# EAGLE design VKeyVoltageKeypad (EAGLE 6.0)
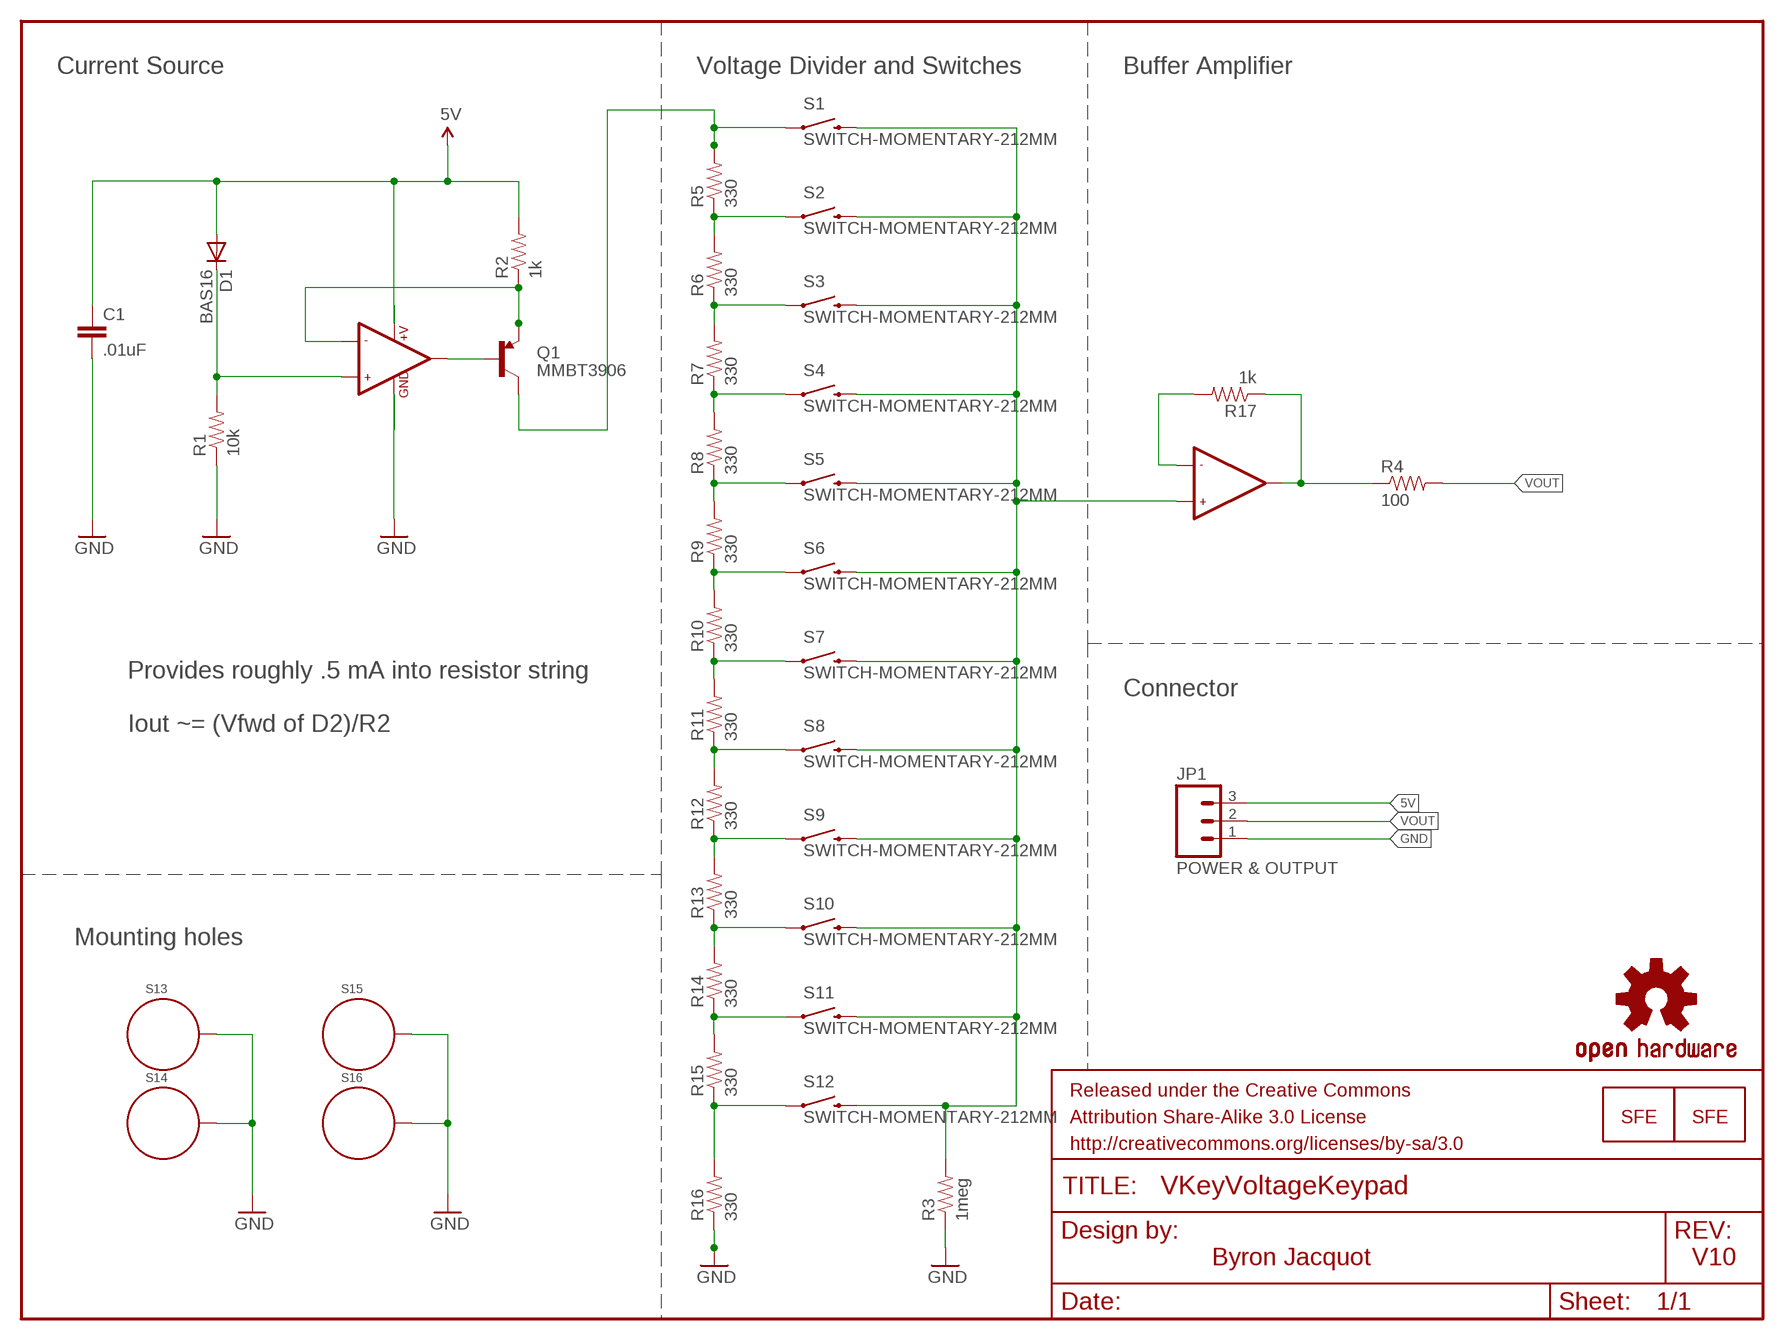
[diagram p0: schematic, sheet 1]

## Parts
C1  .01uF  10NF/10000PF-50V-10%(0603)  [0603-CAP]
D1  BAS16  DIODESOD  [SOD-323]
FRAME1  FRAME-LETTER  [CREATIVE_COMMONS]
JP1  POWER & OUTPUT  M031X03_NO_SILK  [1X03_NO_SILK]
LOGO1  LOGO-SFENEW  [SFE-NEW-WEBLOGO]
LOGO2  LOGO-SFENEW  [SFE-NEW-WEBLOGO]
LOGO3  OSHW-LOGOM  [OSHW-LOGO-M]
LOGO4  OSHW-LOGOL  [OSHW-LOGO-L]
Q1  MMBT3906  TRANSISTOR_PNPMMBT3906  [SOT23]
R1  10k  10KOHM1/10W1%(0603)0603  [0603-RES]
R2  1k  1KOHM1/10W1%(0603)  [0603-RES]
R3  1meg  1M-1%  [0603-RES]
R4  100  100OHM1/10W1%(0603)  [0603-RES]
R5  330  330OHM1/10W1%(0603)  [0603-RES]
R6  330  330OHM1/10W1%(0603)  [0603-RES]
R7  330  330OHM1/10W1%(0603)  [0603-RES]
R8  330  330OHM1/10W1%(0603)  [0603-RES]
R9  330  330OHM1/10W1%(0603)  [0603-RES]
R10  330  330OHM1/10W1%(0603)  [0603-RES]
R11  330  330OHM1/10W1%(0603)  [0603-RES]
R12  330  330OHM1/10W1%(0603)  [0603-RES]
R13  330  330OHM1/10W1%(0603)  [0603-RES]
R14  330  330OHM1/10W1%(0603)  [0603-RES]
R15  330  330OHM1/10W1%(0603)  [0603-RES]
R16  330  330OHM1/10W1%(0603)  [0603-RES]
R17  1k  1KOHM1/10W1%(0603)  [0603-RES]
S1  SWITCH-MOMENTARY-212MM  [TACTILE-PTH-12MM]
S2  SWITCH-MOMENTARY-212MM  [TACTILE-PTH-12MM]
S3  SWITCH-MOMENTARY-212MM  [TACTILE-PTH-12MM]
S4  SWITCH-MOMENTARY-212MM  [TACTILE-PTH-12MM]
S5  SWITCH-MOMENTARY-212MM  [TACTILE-PTH-12MM]
S6  SWITCH-MOMENTARY-212MM  [TACTILE-PTH-12MM]
S7  SWITCH-MOMENTARY-212MM  [TACTILE-PTH-12MM]
S8  SWITCH-MOMENTARY-212MM  [TACTILE-PTH-12MM]
S9  SWITCH-MOMENTARY-212MM  [TACTILE-PTH-12MM]
S10  SWITCH-MOMENTARY-212MM  [TACTILE-PTH-12MM]
S11  SWITCH-MOMENTARY-212MM  [TACTILE-PTH-12MM]
S12  SWITCH-MOMENTARY-212MM  [TACTILE-PTH-12MM]
S13  STANDOFF_ELECTRICAL  [STANDOFF-ELECTRICAL]
S14  STANDOFF_ELECTRICAL  [STANDOFF-ELECTRICAL]
S15  STANDOFF_ELECTRICAL  [STANDOFF-ELECTRICAL]
S16  STANDOFF_ELECTRICAL  [STANDOFF-ELECTRICAL]
U1  LMV358  [SO08]

## Nets
5V: C1.1 D1.2(A) JP1.3 R2.2 U1.8(+V)
GND: C1.2 JP1.1 R1.1 R3.1 R16.1 S13.P1 S14.P1 S15.P1 S16.P1 U1.4(GND)
N$1: D1.1(C) R1.2 U1.3(+IN1)
N$2: Q1.1(B) U1.1(OUT1)
N$3: R3.2 S1.3 S2.3 S3.3 S4.3 S5.3 S6.3 S7.3 S8.3 S9.3 S10.3 S11.3 S12.3 U1.5(+IN2)
N$4: R14.1 R15.2 S11.1
N$5: Q1.2(E) R2.1 U1.2(-IN1)
N$6: Q1.3(C) R5.2 S1.1
N$7: R5.1 R6.2 S2.1
N$8: R6.1 R7.2 S3.1
N$9: R7.1 R8.2 S4.1
N$10: R8.1 R9.2 S5.1
N$11: R9.1 R10.2 S6.1
N$12: R10.1 R11.2 S7.1
N$13: R11.1 R12.2 S8.1
N$14: R12.1 R13.2 S9.1
N$15: R13.1 R14.2 S10.1
N$16: R15.1 R16.2 S12.1
N$17: R4.1 R17.1 U1.7(OUT2)
N$18: R17.2 U1.6(-IN2)
VOUT: JP1.2 R4.2

## Notes on the sheet
- Current Source | Voltage Divider and Switches | Buffer Amplifier
- Provides roughly .5 mA into resistor string
- Connector
- Iout ~= (Vfwd of D2)/R2
- Mounting holes
- Byron Jacquot | V10

## Library data of the parts
C1 = SparkFun-Capacitors:10NF/10000PF-50V-10%(0603): CAP-00867; PROD_ID: CAP-00867; VALUE: 10nF
D1 = SparkFun-DiscreteSemi:DIODE: Diode These are standard reverse protection diodes and small signal diodes. SMA package can handle up to about 1A. SOD-323 can handle about 200mA. What the SOD-323 package when ordering, there are some mfgs out there that are 5-pin packages.; PROD_ID: DIO-09646
FRAME1 = SparkFun-Aesthetics:FRAME-LETTER: Schematic Frame Standard 8.5x11 US Letter frame
JP1 = SparkFun-Connectors:M03: Header 3 Standard 3-pin 0.1" header. Use with straight break away headers (SKU : PRT-00116), right angle break away headers (PRT-00553), swiss pins (PRT-00743), machine pins (PRT-00117), and female headers (PRT-00115). Molex polarized connector foot print use with SKU : PRT-08232 with associated crimp pins and housings.
LOGO1 LOGO2 = SparkFun-Aesthetics:LOGO-SFE: Spark Fun Electronics PCB Logo This is the standard Spark Fun Electronics PCB logo.
LOGO3 LOGO4 = SparkFun-Aesthetics:OSHW-LOGO: Open Source Hardware Logo This logo indicates the piece of hardware it is found on incorporates a OSHW license and/or adheres to the definition of open source hardware found here: http://freedomdefined.org/OSHW
Q1 = SparkFun-DiscreteSemi:TRANSISTOR_PNP: Generic PNP BJT Double check pinouts against datasheets- not all devices are the same! MMBT3906 - 40V 200mA SOT-23 (TRANS-08052) MMBT4403 - 40V 600mA SOT-23 (TRANS-09245); PROD_ID: TRANS-08052
R1 = SparkFun-Resistors:10KOHM1/10W1%(0603): RES-00824; PROD_ID: RES-00824; VALUE: 10K
R2 R17 = SparkFun-Resistors:1KOHM1/10W1%(0603): RES-07856; PROD_ID: RES-07856; VALUE: 1K
R3 = SparkFun-Resistors:1M-1%: 1M-ohm SMT 1/10W - 1% (0603) RES-07868; PROD_ID: RES-07868; VALUE: 1M
R4 = SparkFun-Resistors:100OHM1/10W1%(0603): RES-07863; PROD_ID: RES-07863
R5-R16 = SparkFun-Resistors:330OHM1/10W1%(0603): RES-00818; PROD_ID: RES-00818
S1-S12 = SparkFun-Electromechanical:SWITCH-MOMENTARY-2: Various NO switches- pushbuttons, reed, etc; PROD_ID: SWCH-09185
S13-S16 = SparkFun-Electromechanical:STANDOFF_ELECTRICAL: A standoff intended to be an electrically connected point. Pad size and stop size allow for a #4 Phillips pan screw head to make a solid connection to the board.
U1 = SparkFun-AnalogIC:LMV358: Jellybean rail-to-rail output op-amp; PROD_ID: IC-09657

## Board
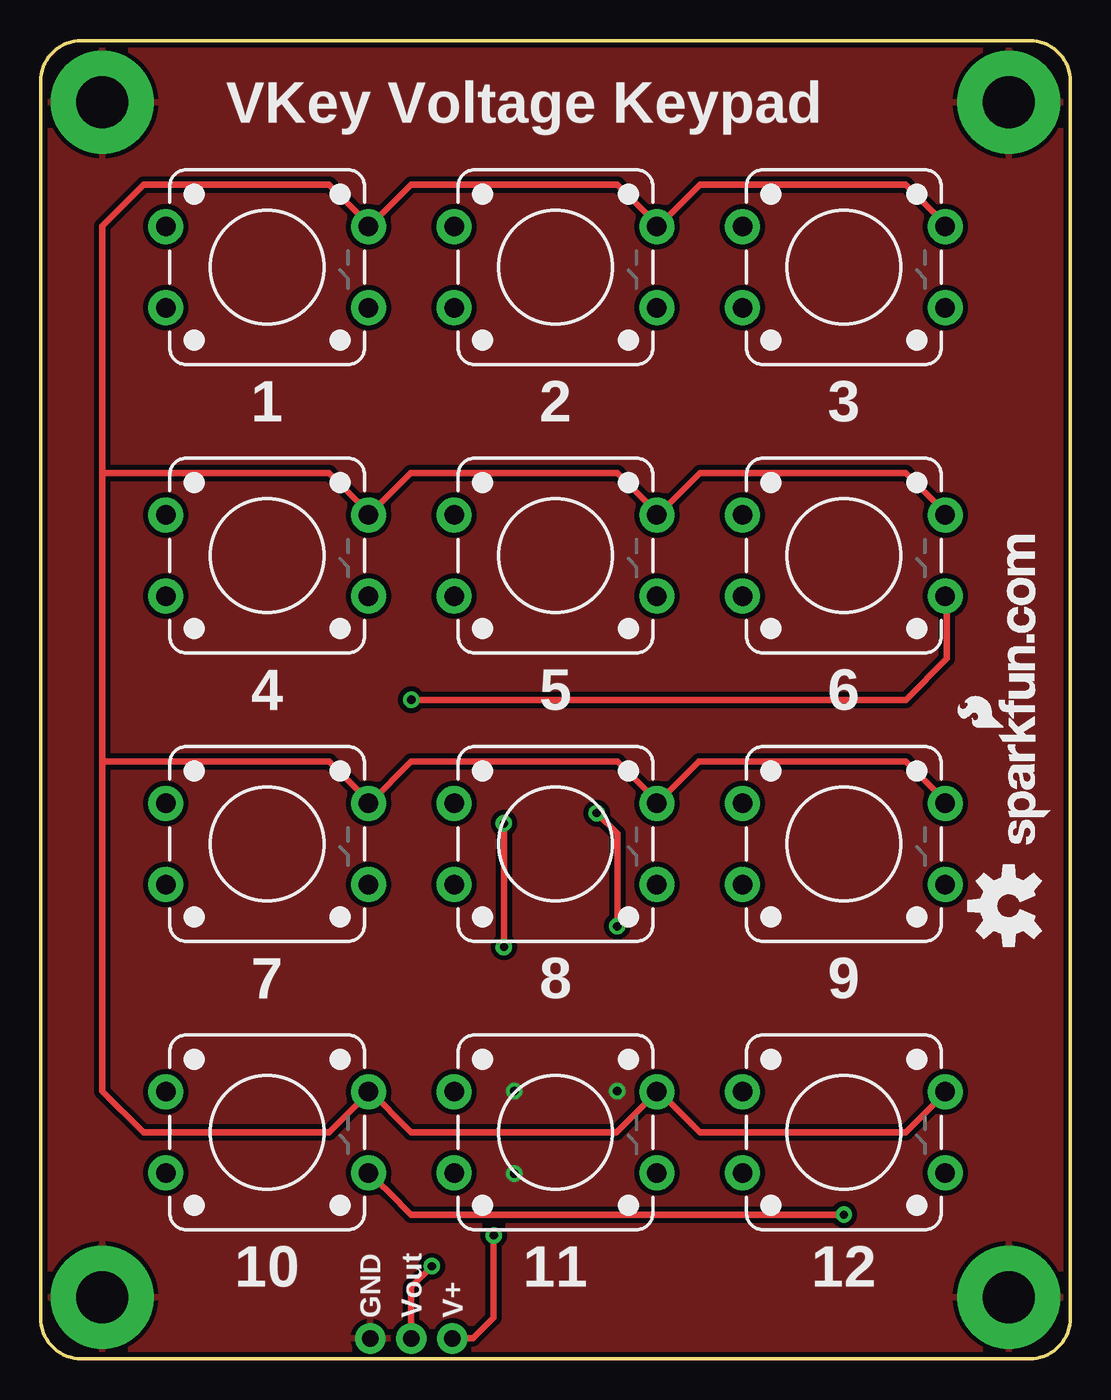
[diagram p1: board, top side]
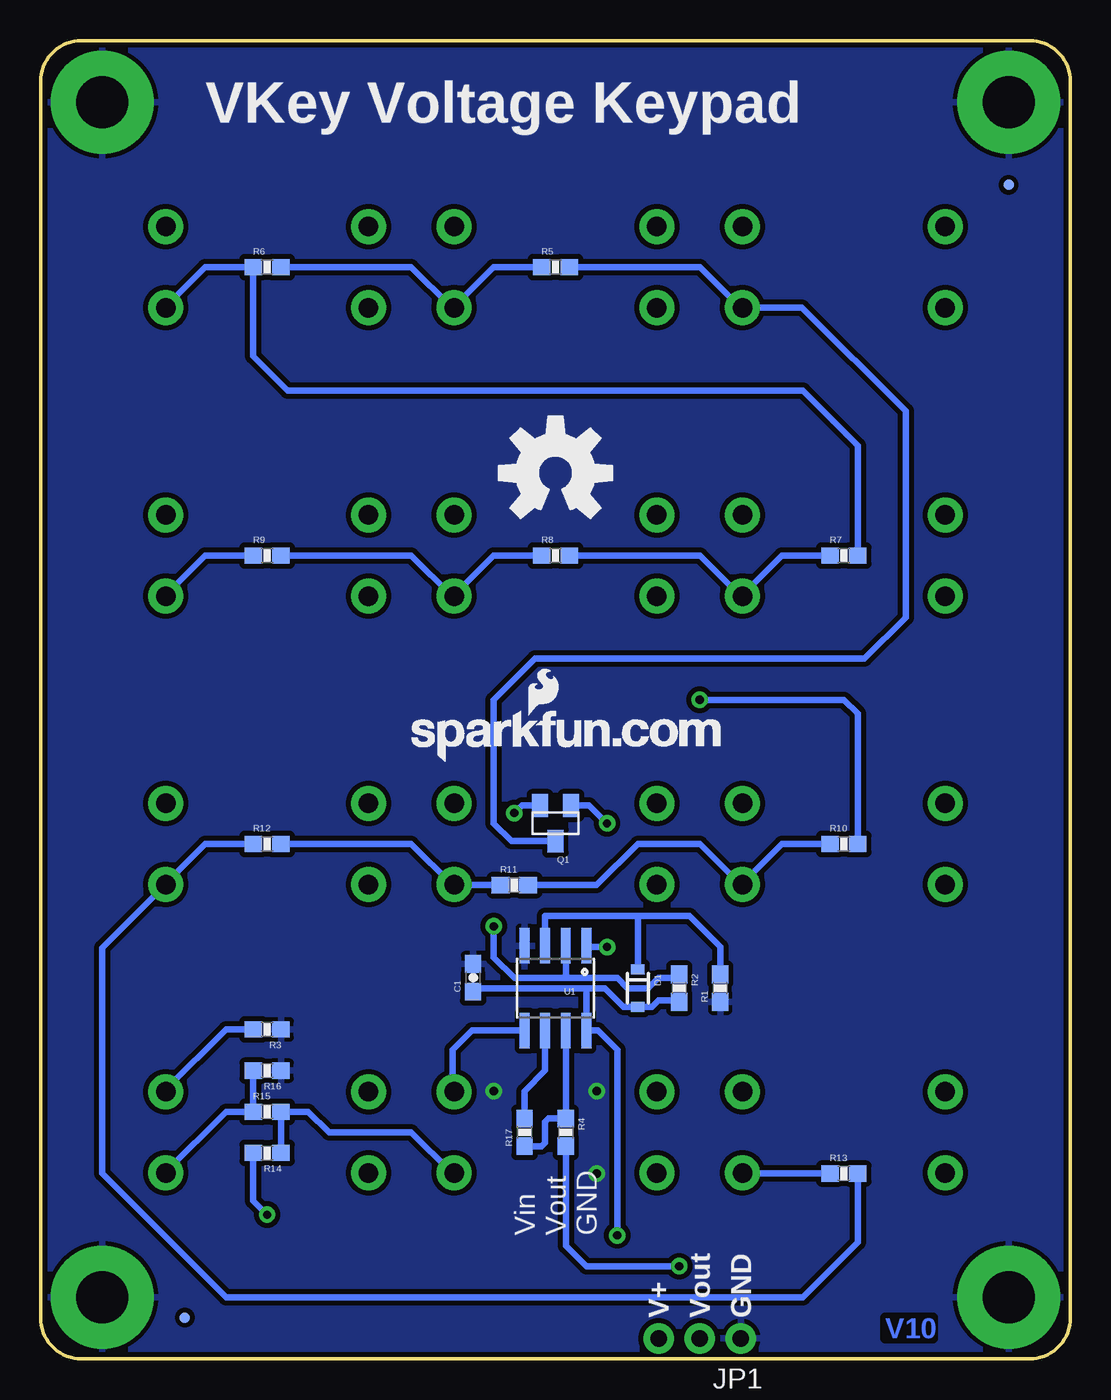
[diagram p2: board, bottom side, seen from below]

Size 63.5 x 81.28 mm. Coordinates in mm from the lower left corner, seen from the top.
Outline: 0,78.74 0,2.54 arc90 2.54,0 60.96,0 arc90 63.5,2.54 63.5,78.74 arc90 60.96,81.28 2.54,81.28 arc90 0,78.74
Copper layers (1*16): Top 0.035mm / dielectric 1.5mm / Bottom 0.035mm
Design rules "default": minimum track width 7mil, minimum drill 15mil, track to track 8mil, track to pad 8mil, pad to pad 8mil, via to via 8mil, smd to smd 8mil, copper to edge 8mil, drill to drill 8mil, minimum pad ring 12mil, minimum via ring 10mil, stop-mask expansion 4mil, vias tented up to drill 20mil, thermal gap 10mil

### Footprints (pad centres in the part's own frame; a part is rotated, then mirrored left to right if it is on the bottom)
0603-CAP = smd 1.1 x 1: 1 -0.85,0; 2 0.85,0
SOD-323 = smd 0.63 x 0.83: 1 -1.15,0; 2 1.15,0
MICRO-FIDUCIAL = smd 0.635 x 0.635: 1 0,0
1X03_NO_SILK = drill 1.016 pad 1.88: 1 0,0; 2 2.54,0; 3 5.08,0
SOT23 = smd 1 x 1.4: 1 -0.95,-1.1; 2 0.95,-1.1; 3 0,1.1
0603-RES = smd 1.1 x 1: 1 -0.85,0; 2 0.85,0
TACTILE-PTH-12MM = drill 1.2 pad 2.159: 1 6.25,-2.5; 2 -6.25,-2.5; 3 6.25,2.5; 4 -6.25,2.5
STANDOFF-ELECTRICAL = drill 3.2 pad 6.35: P1 0,0
SO08 = smd 0.61 x 2.21: 1 -1.905,-2.616; 2 -0.635,-2.616; 3 0.635,-2.616; 4 1.905,-2.616; 5 1.905,2.616; 6 0.635,2.616; 7 -0.635,2.616; 8 -1.905,2.616

### Placement (x,y rotation side)
C1  36.83,23.5 90 bottom
D1  26.67,22.86 270 bottom
FID1  FIDUCIALUFIDUCIAL  [MICRO-FIDUCIAL]  54.61,2.54 0 bottom
FID2  FIDUCIALUFIDUCIAL  [MICRO-FIDUCIAL]  3.81,72.39 0 bottom
FRAME1  13.97,-10.16 0 top  (outside the outline)
JP1  20.32,1.27 180 bottom
LOGO1  62.23,31.75 90 top
LOGO2  40.64,36.83 0 bottom
LOGO3  59.69,27.94 90 top
LOGO4  31.75,54.61 0 bottom
Q1  31.75,33.02 180 bottom
R1  21.59,22.86 90 bottom
R2  24.13,22.86 270 bottom
R3  49.53,20.32 180 bottom
R4  31.11,13.97 270 bottom
R5  31.75,67.31 0 bottom
R6  49.53,67.31 0 bottom
R7  13.97,49.53 0 bottom
R8  31.75,49.53 0 bottom
R9  49.53,49.53 0 bottom
R10  13.97,31.75 0 bottom
R11  34.29,29.21 0 bottom
R12  49.53,31.75 0 bottom
R13  13.97,11.43 0 bottom
R14  49.53,12.7 180 bottom
R15  49.53,15.24 0 bottom
R16  49.53,17.78 180 bottom
R17  33.66,13.97 90 bottom
S1  13.97,67.31 0 top
S2  31.75,67.31 0 top
S3  49.53,67.31 0 top
S4  13.97,49.53 0 top
S5  31.75,49.53 0 top
S6  49.53,49.53 0 top
S7  13.97,31.75 0 top
S8  31.75,31.75 0 top
S9  49.53,31.75 0 top
S10  13.97,13.97 0 top
S11  31.75,13.97 0 top
S12  49.53,13.97 0 top
S13  59.69,77.47 0 top
S14  59.69,3.81 0 top
S15  3.81,3.81 0 top
S16  3.81,77.47 0 top
U1  31.75,22.86 180 bottom

### Tracks (layer width: path | path; a pad name or v marks a point on that pad's centre or on a via)
5V  (via drill 0.51)
  Top 0.406: JP1.3 26.67,1.27 27.94,2.54 v27.94,7.62
  Bottom 0.406: 29.84,22.86 36.62,22.86 C1.1 | v27.94,7.62 27.94,19.05 29.13,20.24 U1.8 29.84,22.86 | 29.84,22.86 28.7,22.86 27.55,21.71 D1.2 25.79,21.71 25.4,22.1 25.39,22.09 24.21,22.09 R2.2
GND  (via drill 0.51)
  other vias: 35.56,16.51 29.21,16.51 29.21,11.43
  pour Bottom (isolate 0.305): 60.17,0.64 3.33,0.64 arc-90 0.64,3.33 0.64,77.95 arc-90 3.33,80.64 60.17,80.64 arc-90 62.87,77.95 62.87,3.33 arc-90
  pour Top (isolate 0.305): 60.17,0.64 3.33,0.64 arc-90 0.64,3.33 0.64,77.95 arc-90 3.33,80.64 60.17,80.64 arc-90 62.87,77.95 62.87,3.33 arc-90
N$1
  Bottom 0.406: 26.67,27.3 23.5,27.3 21.59,25.4 R1.2 | 26.67,27.3 32.38,27.3 U1.3 | D1.1 26.67,27.3
N$2  (via drill 0.51)
  Top 0.406: v28.57,25.4 v28.57,33.02
  Bottom 0.406: v28.57,33.02 29.68,34.12 Q1.1 | U1.1 29.77,25.4 v28.57,25.4
N$3
  Top 0.406: S1.3 20.28,69.81 20.28,69.89 | 55.78,69.75 S3.3 55.78,69.95 53.34,72.39 40.64,72.39 38.06,69.81 S2.3 38,69.95 35.56,72.39 22.86,72.39 20.36,69.89 20.28,69.89 | S8.3 38,34.19 | 55.92,52.03 S6.3 55.78,52.17 53.34,54.61 40.64,54.61 38.06,52.03 S5.3 38,52.17 35.56,54.61 22.8,54.61 S4.3 20.22,52.17 17.78,54.61 3.81,54.61 | S8.3 38,34.39 35.56,36.83 22.86,36.83 20.28,34.25 S7.3 20.22,34.39 17.78,36.83 3.81,36.83 | 20.28,69.89 17.78,72.39 6.35,72.39 3.81,69.85 3.81,54.61 | 3.81,54.61 3.81,36.83 | 3.81,36.83 3.81,16.51 6.35,13.97 17.78,13.97 20.22,16.41 S10.3 20.22,16.61 22.86,13.97 35.5,13.97 S11.3 38,16.61 40.64,13.97 53.34,13.97 55.78,16.41 S12.3 | S9.3 55.78,34.39 53.34,36.83 40.58,36.83 S8.3
  Bottom 0.406: S11.3 38.1,16.57 38.1,19.05 36.91,20.24 U1.5 | S12.3 55.78,16.61 52.07,20.32 R3.2
N$4
  Bottom 0.406: S11.1 38.14,11.47 40.64,13.97 45.72,13.97 46.99,15.24 R15.2 R14.1
N$5  (via drill 0.51)
  Top 0.406: v34.29,33.66 35.56,32.38 v35.56,26.67
  Bottom 0.406: v34.29,33.66 33.83,34.12 Q1.2 | 31.11,23.5 34.29,23.5 35.56,24.77 v35.56,26.67 | R2.1 24.34,23.5 25.4,23.5 26.04,22.86 27.3,22.86 27.94,23.5 31.11,23.5 | U1.2 31.11,23.5
N$6
  Bottom 0.406: R5.2 22.86,67.31 20.36,64.81 S1.1 16.55,64.81 10.16,58.42 10.16,45.72 12.7,43.18 33.02,43.18 35.56,40.64 35.56,33.02 34.46,31.92 Q1.3
N$7
  Bottom 0.406: R5.1 35.56,67.31 38,64.87 | S2.1 38,64.87 | 38,64.87 38.2,64.87 40.64,67.31 R6.2
N$8
  Bottom 0.406: S3.1 55.78,64.87 53.34,67.31 R6.1 50.38,61.81 48.26,59.69 16.51,59.69 13.12,56.3 R7.2
N$9
  Bottom 0.406: S4.1 20.22,47.09 | 20.22,47.09 17.78,49.53 R7.1 | 20.22,47.09 20.42,47.09 22.86,49.53 R8.2
N$10
  Bottom 0.406: R8.1 35.56,49.53 38,47.09 S5.1 38.14,47.03 40.64,49.53 R9.2
N$11  (via drill 0.51)
  Top 0.406: S6.1 55.88,46.93 55.88,43.18 53.34,40.64 v22.86,40.64
  Bottom 0.406: S6.1 55.78,47.09 53.34,49.53 R9.1 | v22.86,40.64 13.97,40.64 13.12,39.79 R10.2
N$12
  Bottom 0.406: R10.1 17.78,31.75 20.22,29.31 S7.1 20.36,29.25 22.86,31.75 26.67,31.75 29.21,29.21 R11.2
N$13
  Bottom 0.406: R12.2 40.64,31.75 38.14,29.25 S8.1 38.06,29.25 38.1,29.21 R11.1
N$14
  Bottom 0.406: R12.1 53.34,31.75 55.78,29.31 S9.1 59.69,25.34 59.69,11.43 52.07,3.81 16.51,3.81 13.12,7.2 R13.2
N$15  (via drill 0.51)
  Top 0.406: v49.53,8.89 22.86,8.89 21.49,10.26 S10.1
  Bottom 0.406: v49.53,8.89 50.38,9.74 R14.2 | 20.32,11.43 20.28,11.47 S10.1 20.18,11.43 R13.1
N$16
  Bottom 0.406: S12.1 55.78,11.53 52.07,15.24 R15.1 R16.2
N$17
  Bottom 0.406: 33.66,13.08 33.69,13.12 R17.1 32.6,13.12 32.38,13.34 32.38,14.61 32.17,14.82 R4.1 U1.7
N$18
  Bottom 0.406: R17.2 33.66,16.51 32.38,17.78 U1.6
VOUT  (via drill 0.51)
  Top 0.406: v24.13,5.71 22.86,4.45 JP1.2
  Bottom 0.406: R4.2 31.11,6.99 29.84,5.71 v24.13,5.71

### Text on the board
Bottom: V10
tPlace: VKey Voltage Keypad | 1 | 2 | 3 | 4 | 5 | 6 | 7 | 8 | 9 | 10 | 11 | 12 | GND | Vout | V+
bPlace: VKey Voltage Keypad | GND | Vout | V+
bNames: GND | Vout | Vin
tDocu: Byron Jacquot